# EAGLE design ST link V2_my-2 (EAGLE 8.0.0)
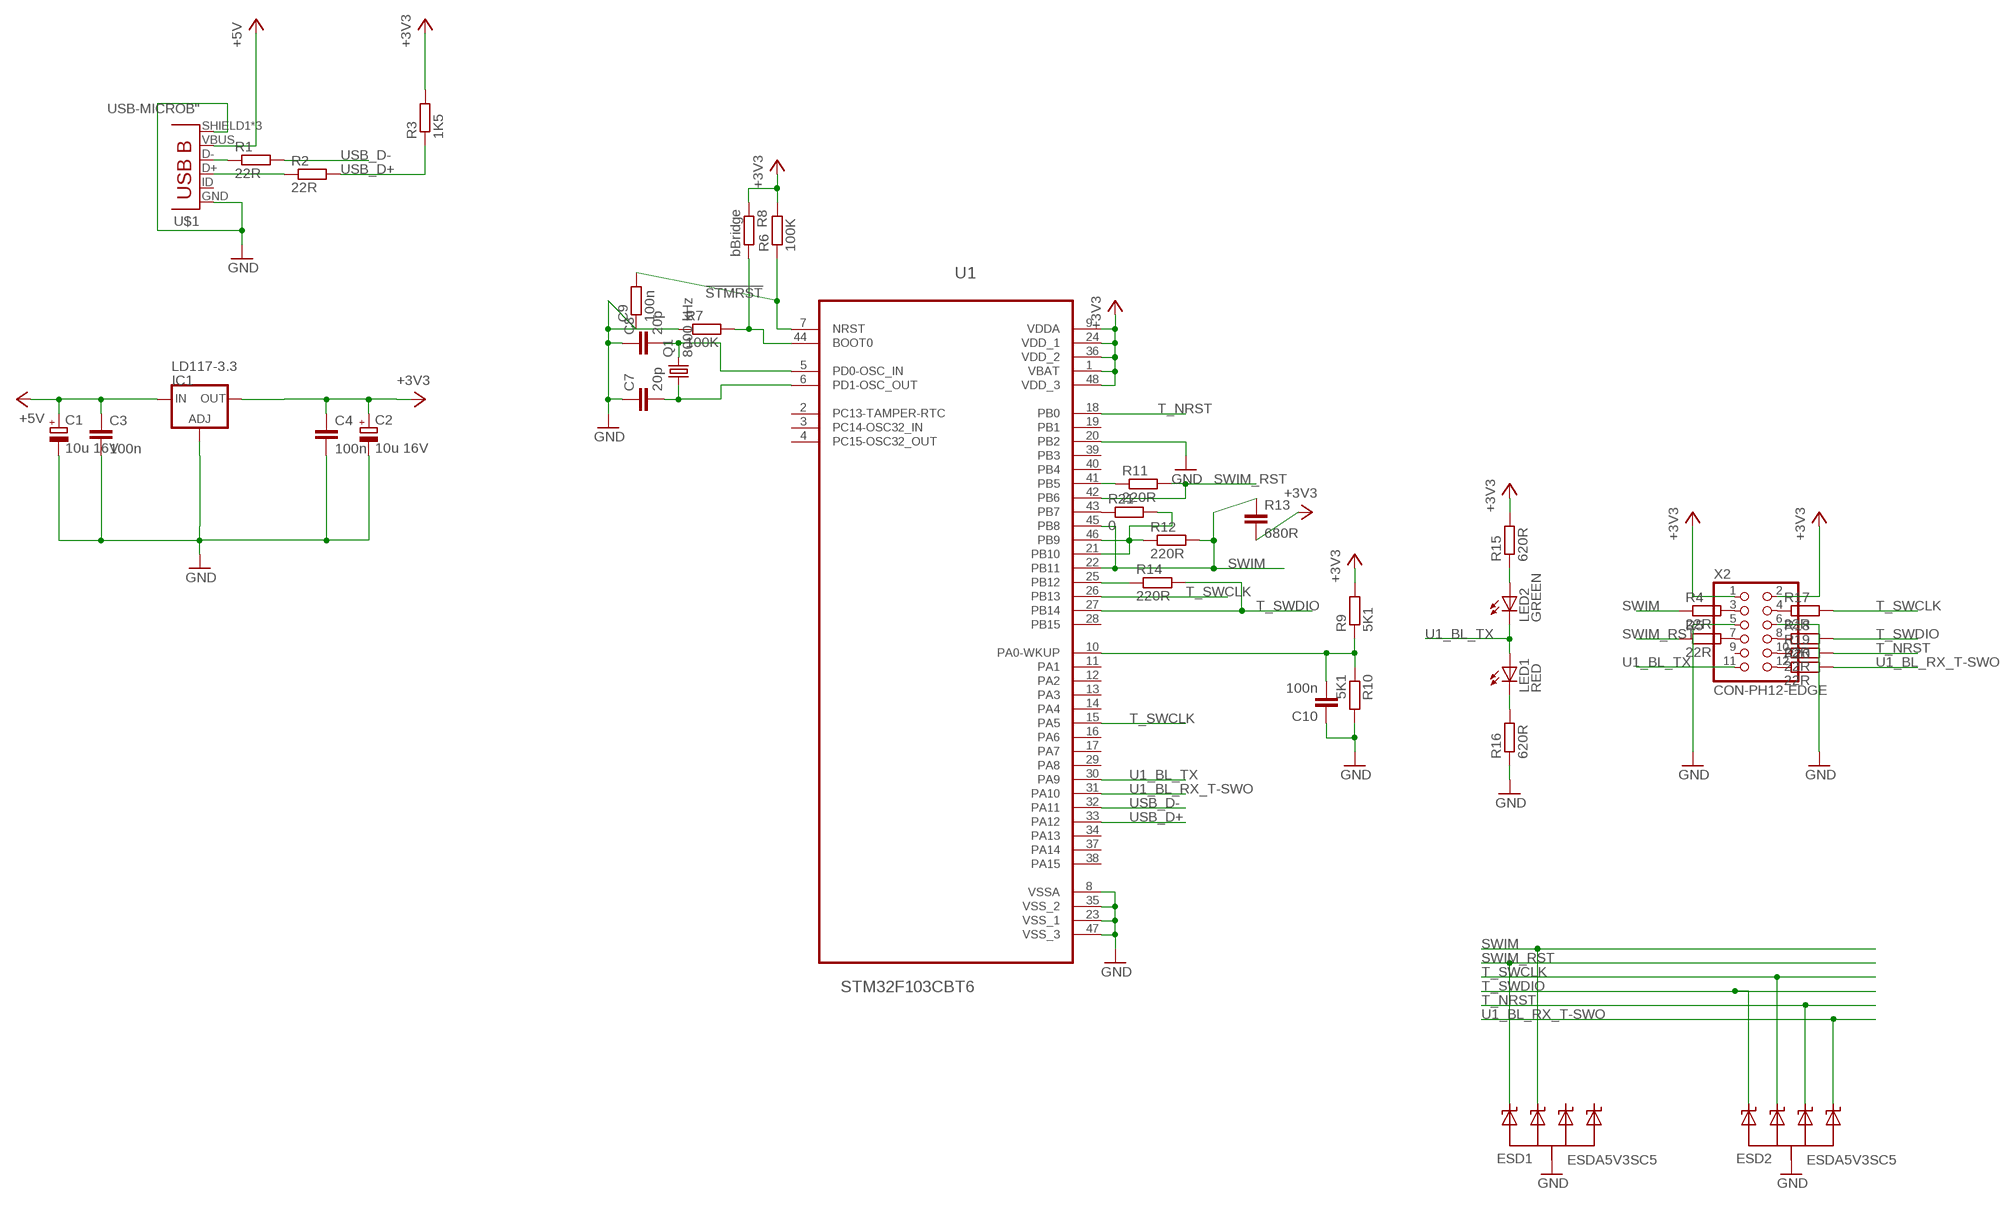
[diagram p0: schematic, sheet 1]

## Parts
C1  10u 16V  CPOL-EUSMCA  [SMC_A]
C2  10u 16V  CPOL-EUSMCA  [SMC_A]
C3  100n  CAP_0805  [C0805]
C4  100n  CAP_0805  [C0805]
C7  20p  CAP_0805  [C0805]
C8  20p  CAP_0805  [C0805]
C9  100n  R_0805  [R0805]
C10  100n  CAP_0805  [C0805]
ESD1  ESDA5V3SC5  ESDAXXSC5  [SOT23-5L]
ESD2  ESDA5V3SC5  ESDAXXSC5  [SOT23-5L]
IC1  LD117-3.3  LD117ASTR  [SOT223]
LED1  RED  LEDCHIPLED_1206  [CHIPLED_1206]
LED2  GREEN  LEDCHIPLED_1206  [CHIPLED_1206]
Q1  8000 kHz  CRYSTALHC49UP  [HC49UP]
R1  22R  R_0805  [R0805]
R2  22R  R_0805  [R0805]
R3  1K5  R_0805  [R0805]
R4  22R  R_0805  [R0805]
R5  22R  R_0805  [R0805]
R6  100K  R_0805  [R0805]
R7  100K  R_0805  [R0805]
R8  bBridge  R_0805  [R0805]
R9  5K1  R_0603  [R0603]
R10  5K1  R_0603  [R0603]
R11  220R  R_0805  [R0805]
R12  220R  R_0805  [R0805]
R13  680R  CAP_0805  [C0805]
R14  220R  R_0805  [R0805]
R15  620R  R_0805  [R0805]
R16  620R  R_0805  [R0805]
R17  22R  R_0805  [R0805]
R18  22R  R_0805  [R0805]
R19  22R  R_0805  [R0805]
R20  22R  R_0805  [R0805]
R21  0  R_0805  [R0805]
U1  STM32F103CBT6  [QFP50P900X900X160-48N]
U$1  USB-MICROB"  [USB-B-MICRO-SMD_V03]
X2  CON-PH12-EDGE  [ML12_EDGE_SMD]

## Nets
!STMRST: C9.2 R6.1 U1.7(NRST)
+3V3: C2.+ C4.1 IC1.4(OUT) R3.2 R6.2 R8.1 R9.2 R13.2 R15.2 U1.1(VBAT) U1.9(VDDA) U1.24(VDD_1) U1.36(VDD_2) U1.48(VDD_3) X2.1 X2.2
+5V: C1.+ C3.1 IC1.3(IN) U$1.VBUS
BOOT0: R7.2 R8.2 U1.44(BOOT0)
GND: C1.- C2.- C3.2 C4.2 C7.1 C8.1 C9.1 C10.1 ESD1.2(A) ESD2.2(A) IC1.1(ADJ) R7.1 R10.2 R16.1 U1.8(VSSA) U1.20(PB2) U1.23(VSS_1) U1.35(VSS_2) U1.47(VSS_3) U$1.GND U$1.SHIELD1(SHIELD) U$1.SHIELD2(SHIELD) U$1.SHIELD3(SHIELD) X2.5 X2.6
N$1: R1.1 U$1.D-
N$2: R2.1 U$1.D+
N$3: R4.2 X2.3
N$4: C10.2 R9.1 R10.1 U1.10(PA0-WKUP)
N$5: R12.1 R21.2 U1.21(PB10) U1.46(PB9)
N$6: C8.2 Q1.2 U1.5(PD0-OSC_IN)
N$7: C7.2 Q1.1 U1.6(PD1-OSC_OUT)
N$8: R11.1 U1.41(PB5)
N$9: R14.1 U1.25(PB12)
N$10: LED2.A R15.1
N$11: R5.2 X2.7
N$12: LED1.C R16.2
N$13: R17.1 X2.4
N$14: R18.1 X2.8
N$15: R19.1 X2.10
N$16: R20.1 X2.12
N$17: R21.1 U1.43(PB7)
SWIM: ESD1.3(C2) R4.1 R12.2 R13.1 U1.22(PB11) U1.45(PB8)
SWIM_RST: ESD1.1(C1) R5.1 R11.2 U1.42(PB6)
T_NRST: ESD2.4(C3) R19.2 U1.18(PB0)
T_SWCLK: ESD2.3(C2) R17.2 U1.15(PA5) U1.26(PB13)
T_SWDIO: ESD2.1(C1) R14.2 R18.2 U1.27(PB14)
U1_BL_RX_T-SWO: ESD2.5(C4) R20.2 U1.31(PA10)
U1_BL_TX: LED1.A LED2.C U1.30(PA9) X2.11
USB_D+: R2.2 R3.1 U1.33(PA12)
USB_D-: R1.2 U1.32(PA11)
Unconnected: ESD1.4(C3) ESD1.5(C4) U1.2(PC13-TAMPER-RTC) U1.3(PC14-OSC32_IN) U1.4(PC15-OSC32_OUT) U1.11(PA1) U1.12(PA2) U1.13(PA3) U1.14(PA4) U1.16(PA6) U1.17(PA7) U1.19(PB1) U1.28(PB15) U1.29(PA8) U1.34(PA13) U1.37(PA14) U1.38(PA15) U1.39(PB3) U1.40(PB4) U$1.ID(USBID) X2.9

## Library data of the parts
C1 C2 = rcl:CPOL-EU: POLARIZED CAPACITOR, European symbol
C3 C4 C7 C8 C10 R13 = Namenlos:CAP_
C9 R1-R12 R14-R21 = Namenlos:R_
ESD1 ESD2 = Namenlos:ESDAXXSC5
IC1 = v-reg:LD117A?*: Low drop fixed and adjustable positive voltage regulators 1 A Source: http://www.st.com/stonline/products/literature/ds/7194/ld1117axx.pdf
LED1 LED2 = led:LED: LED OSRAM: - CHIPLED LG R971, LG N971, LY N971, LG Q971, LY Q971, LO R971, LY R971 LH N974, LH R974 LS Q976, LO Q976, LY Q976 LO Q996 - Hyper CHIPLED LW Q18S LB Q993, LB Q99A, LB R99A - SideLED LS A670, LO A670, LY A670, LG A670, LP A670 LB A673, LV A673, LT A673, LW A673 LH A674 LY A675 LS A676, LA A676, LO A676, LY A676, LW A676 LS A679, LY A679, LG A679 - Hyper Micro SIDELED® LS Y876, LA Y876, LO Y876, LY Y876 LT Y87S - SmartLED LW L88C, LW L88S LB L89C, LB L89S, LG L890 LS L89K, LO L89K, LY L89K LS L896, LA L896, LO L896, LY L896 - TOPLED LS T670, LO T670, LY T670, LG T670, LP T670 LSG T670, LSP T670, LSY T670, LOP T670, LYG T670 LG T671, LOG T671, LSG T671 LB T673, LV T673, LT T673, LW T673 LH T674 LS T676, LA T676, LO T676, LY T676, LB T676, LH T676, LSB T676, LW T676 LB T67C, LV T67C, LT T67C, LS T67K, LO T67K, LY T67K, LW E67C LS E67B, LA E67B, LO E67B, LY E67B, LB E67C, LV E67C, LT E67C LW T67C LS T679, LY T679, LG T679 LS T770, LO T770, LY T770, LG T770, LP T770 LB T773, LV T773, LT T773, LW T773 LH T774 LS E675, LA E675, LY E675, LS T675 LS T776, LA T776, LO T776, LY T776, LB T776 LHGB T686 LT T68C, LB T68C - Hyper Mini TOPLED® LB M676 - Mini TOPLED Santana® LG M470 LS M47K, LO M47K, LY M47K Source: http://www.osram.convergy.de LUXEON: - LUMILED® LXK2-PW12-R00, LXK2-PW12-S00, LXK2-PW14-U00, LXK2-PW14-V00 LXK2-PM12-R00, LXK2-PM12-S00, LXK2-PM14-U00 LXK2-PE12-Q00, LXK2-PE12-R00, LXK2-PE12-S00, LXK2-PE14-T00, LXK2-PE14-U00 LXK2-PB12-K00, LXK2-PB12-L00, LXK2-PB12-M00, LXK2-PB14-N00, LXK2-PB14-P00, LXK2-PB14-Q00 LXK2-PR12-L00, LXK2-PR12-M00, LXK2-PR14-Q00, LXK2-PR14-R00 LXK2-PD12-Q00, LXK2-PD12-R00, LXK2-PD12-S00 LXK2-PH12-R00, LXK2-PH12-S00 LXK2-PL12-P00, LXK2-PL12-Q00, LXK2-PL12-R00 Source: www.luxeon.com KINGBRIGHT: KA-3528ASYC Source: www.kingbright.com
Q1 = crystal:CRYSTAL: CRYSTAL; OC_FARNELL: unknown; OC_NEWARK: unknown
U1 = ST Microelctronics_By_element14_Batch_1:STM32F103CBT6: Medium-density performance line ARM-based 32-bit MCU; MPN: STM32F103CBT6; OC_FARNELL: 1606327; OC_NEWARK: 11N8296; PACKAGE: QFP-48; SUPPLIER: STMICROELECTRONICS
U$1 = SparkFun-Connectors:USB-MICROB; PROD_ID: CONN-11752
X2 = Namenlos:CON-PH12-EDGE

## Board
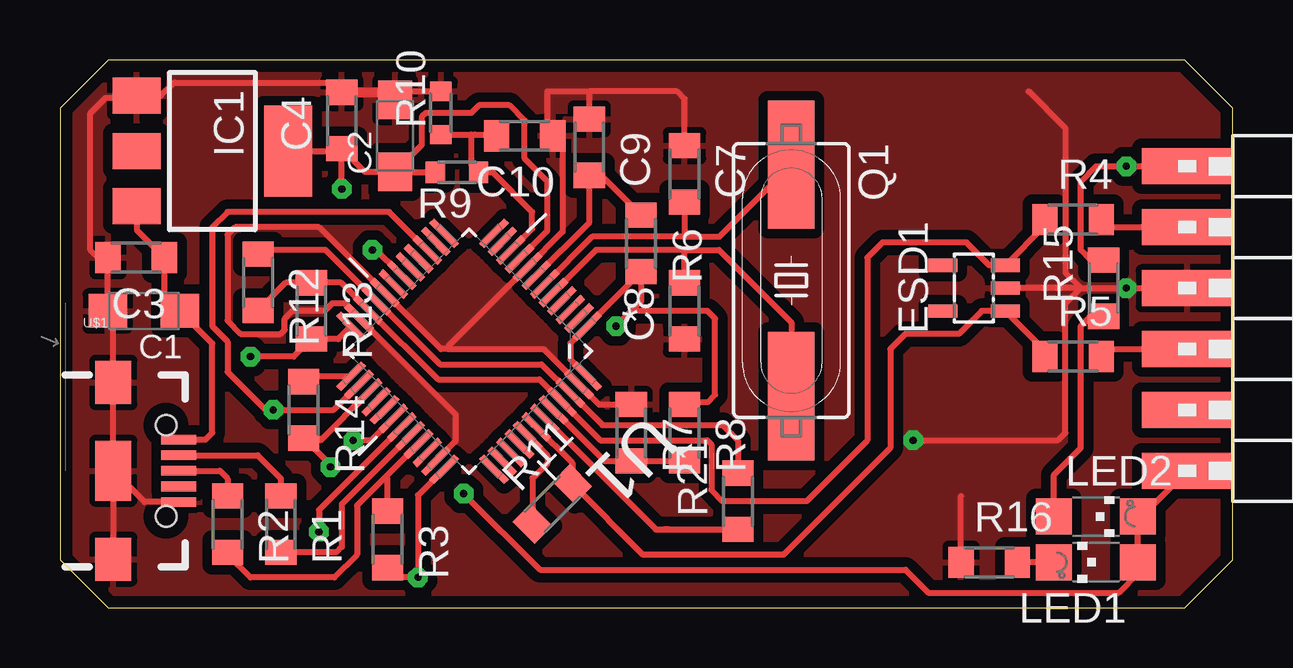
[diagram p1: board, top side]
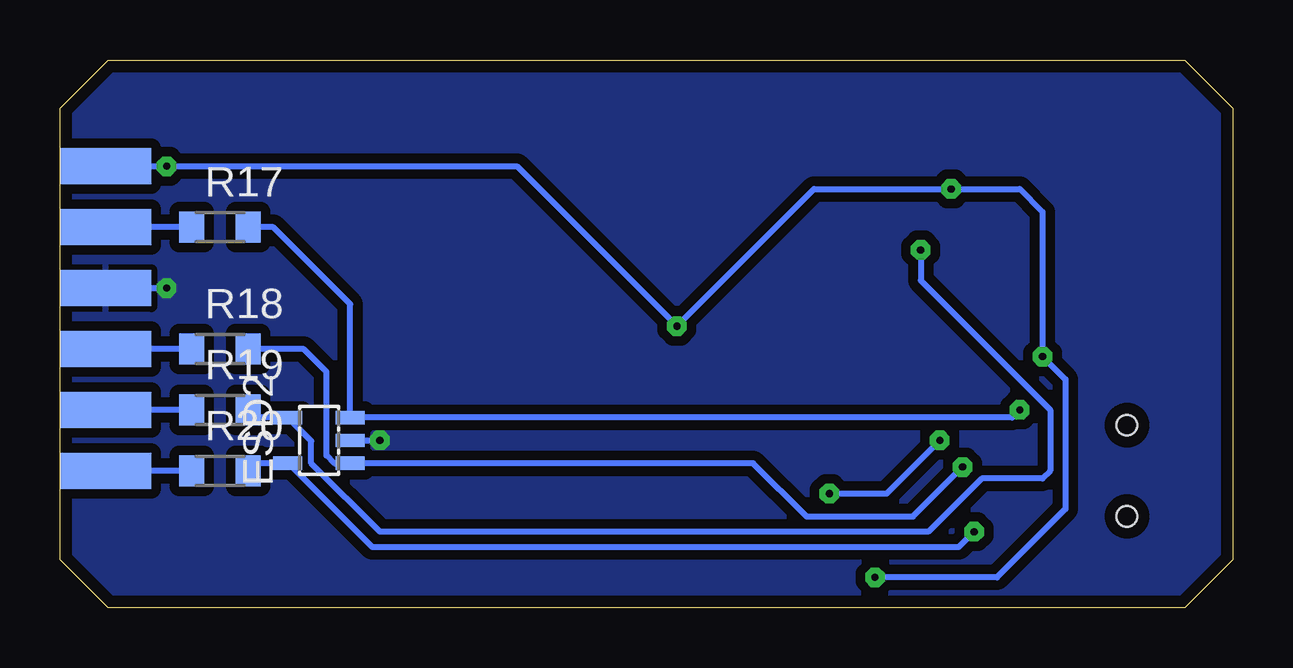
[diagram p2: board, bottom side, seen from below]

Size 48.88 x 22.85 mm. Coordinates in mm from the lower left corner, seen from the top.
Outline: 46.87,22.85 2,22.85 0,20.85 0,2 2,0 46.87,0 48.87,2 48.87,20.85 46.87,22.85
Copper layers (1*16): Top 0.035mm / dielectric 1.5mm / Bottom 0.035mm
Design rules "EagleDesignRules *": minimum track width 0.2mm, minimum drill 0.3mm, track to track 0.2mm, track to pad 0.2mm, pad to pad 0.2mm, via to via 0.2mm, smd to smd 0.2mm, copper to edge 0.5mm, drill to drill 0.2mm, minimum pad ring 10mil, minimum via ring 8mil, stop-mask expansion 4mil, vias tented up to drill 0mil, thermal gap 0.25mm

### Footprints (pad centres in the part's own frame; a part is rotated, then mirrored left to right if it is on the bottom)
SMC_A = smd 1.6 x 1.4: + -1.5,0; - 1.5,0
C0805 = smd 1.05 x 1.3: 1 -1.175,0; 2 1.175,0
R0805 = smd 1.05 x 1.3: 1 -1.175,0; 2 1.175,0
SOT23-5L = smd 0.55 x 1.2: 1 -0.95,-1.3; 2 0,-1.3; 3 0.95,-1.3; 4 0.95,1.3; 5 -0.95,1.3
SOT223 = smd 1.5 x 2: 1 -2.3,-3.15; 2 0,-3.15; 3 2.3,-3.15 | smd 3.8 x 2: 4 0,3.15
CHIPLED_1206 = smd 1.5 x 1.5: A 0,-1.75; C 0,1.75
HC49UP = smd 5.334 x 1.93: 1 -4.826,0; 2 4.826,0
R0603 = smd 0.8 x 0.9: 1 -0.9,0; 2 0.9,0
QFP50P900X900X160-48N = smd 1.473 x 0.279: 1 -4.216,2.743; 2 -4.216,2.261; 3 -4.216,1.753; 4 -4.216,1.245; 5 -4.216,0.762; 6 -4.216,0.254; 7 -4.216,-0.254; 8 -4.216,-0.762; 9 -4.216,-1.245; 10 -4.216,-1.753; 11 -4.216,-2.261; 12 -4.216,-2.743; 25 4.216,-2.743; 26 4.216,-2.261; 27 4.216,-1.753; 28 4.216,-1.245; 29 4.216,-0.762; 30 4.216,-0.254; 31 4.216,0.254; 32 4.216,0.762; 33 4.216,1.245; 34 4.216,1.753; 35 4.216,2.261; 36 4.216,2.743 | smd 0.279 x 1.473: 13 -2.743,-4.216; 14 -2.261,-4.216; 15 -1.753,-4.216; 16 -1.245,-4.216; 17 -0.762,-4.216; 18 -0.254,-4.216; 19 0.254,-4.216; 20 0.762,-4.216; 21 1.245,-4.216; 22 1.753,-4.216; 23 2.261,-4.216; 24 2.743,-4.216; 37 2.743,4.216; 38 2.261,4.216; 39 1.753,4.216; 40 1.245,4.216; 41 0.762,4.216; 42 0.254,4.216; 43 -0.254,4.216; 44 -0.762,4.216; 45 -1.245,4.216; 46 -1.753,4.216; 47 -2.261,4.216; 48 -2.743,4.216
USB-B-MICRO-SMD_V03 = smd 1.45 x 0.4: D+ 2.725,0; D- 2.725,0.65; GND 2.725,-1.3; ID 2.725,-0.65; VBUS 2.725,1.3 | smd 1.5 x 1.8: SHIELD1 0,3.685; SHIELD2 0,-3.685 | smd 1.5 x 2.5: SHIELD3 0,0 | hole 0.85: 2.2,1.9; 2.2,-1.9
ML12_EDGE_SMD = smd 1.5 x 3.81: 1 -6.35,-6.35; 3 -3.81,-6.35; 5 -1.27,-6.35; 7 1.27,-6.35; 9 3.81,-6.35; 11 6.35,-6.35 | smd 1.5 x 3.81 bottom: 2 -6.35,-6.35; 4 -3.81,-6.35; 6 -1.27,-6.35; 8 1.27,-6.35; 10 3.81,-6.35; 12 6.35,-6.35

### Placement (x,y rotation side)
C1  3.49,12.38 180 top
C2  13.97,19.68 90 top
C3  3.17,14.61 180 top
C4  11.75,20.32 90 top
C7  26.04,18.1 270 top
C8  26.04,12.38 90 top
C9  22.07,19.21 270 top
C10  19.37,19.68 180 top
ESD1  38.1,13.34 90 top
ESD2  38.1,6.99 90 bottom
IC1  6.35,19.05 270 top
LED1  43.18,1.9 90 top
LED2  43.18,3.81 270 top
Q1  30.48,13.65 270 top
R1  9.21,3.49 270 top
R2  6.99,3.49 270 top
R3  13.65,2.86 270 top
R4  42.23,16.19 0 top
R5  42.23,10.48 0 top
R6  24.22,15.2 270 top
R7  23.81,7.3 270 top
R8  26.04,7.3 270 top
R9  16.55,18.16 180 top
R10  15.88,20.64 90 top
R11  20.53,4.33 45 top
R12  8.26,13.57 270 top
R13  10.48,12.38 270 top
R14  10.16,8.26 270 top
R15  43.5,13.34 90 top
R16  38.73,1.9 0 top
R17  42.23,15.88 0 bottom
R18  42.23,10.79 0 bottom
R19  42.23,8.26 0 bottom
R20  42.23,5.71 0 bottom
R21  28.26,4.45 90 top
U1  17.05,10.7 225 top
U$1  2.22,5.71 0 top
X2  53.34,12.07 270 top

### Tracks (layer width: path | path; a pad name or v marks a point on that pad's centre or on a via)
!STMRST
  Top 0.254: C9.2 22.38,18.03 | C9.2 22.07,16.08 U1.7 | R6.1 22.57,18.03 C9.2
+3V3  (via drill 0.3 pad 0.81)
  Top 0.254: IC1.4 11.65,19.05 C4.1 | v7.94,10.48 9.75,10.48 R13.2 11.59,11.21 U1.24 | U1.36 14.92,4.69 v14.92,1.27 14.07,1.27 R3.2 | U1.48 21.27,10.36 21.27,11.04 U1.1 24.22,13.99 R6.2 24.22,12.79 v23.18,11.75 | 14.31,18.16 R9.2 | v23.18,11.75 v23.17,11.74 | X2.2 v44.45,18.42 43.18,18.42 42.54,17.78 42.54,14.92 42.96,14.51 R15.2 | v11.75,17.46 C4.1 | C2.+ 12.71,18.18 C4.1 | R8.1 26.13,8.57 26.99,8.57 27.31,8.89 27.31,12.07 26.99,12.38 23.81,12.38 v23.18,11.75 | U1.9 20.32,15.73 20.32,17.78 19.37,18.73 19.37,20.32 18.73,20.95 17.46,20.95 17.15,20.64 15.24,20.64 15.08,20.48 15.08,19.3 C2.+ | C2.+ 14.29,18.18 | 14.29,18.18 14.31,18.16 | C2.+ 14.29,18.18 | 14.29,18.18 14.31,18.16
  Bottom 0.254: v14.92,1.27 9.84,1.27 6.99,4.13 6.99,9.52 v7.94,10.48 7.94,16.51 8.89,17.46 v11.75,17.46 17.46,17.46 v23.18,11.75 29.84,18.42 v44.45,18.42 X2.2
+5V
  Top 0.254: U$1.VBUS 6.06,7.01 6.35,7.3 6.35,11.02 C1.+ 4.35,13.02 C3.1 3.2,15.76 IC1.3
BOOT0
  Top 0.254: U1.44 22.7,6.13 R7.2 R8.2
GND  (via drill 0.3 pad 0.81)
  Top 0.254: 42.54,13.34 ESD1.2 | 42.54,13.34 v44.45,13.34 X2.6 | U$1.SHIELD3 U$1.SHIELD2 | U$1.SHIELD3 U$1.SHIELD1 2.22,12.15 C1.- C3.2 1.59,14.6 1.27,14.92 1.27,20.64 1.9,21.27 3.12,21.27 IC1.1 4.21,21.35 4.76,21.91 11.34,21.91 C4.2 | U$1.GND 3.52,4.42 U$1.SHIELD3 | U1.35 15.67,6.14 16.51,6.99 16.51,8.05 U1.23 11.86,12.7 11.35,12.7 11.03,12.38 9.68,12.38 9.37,12.07 9.37,11.59 9.21,11.43 7.54,11.43 6.99,11.99 6.99,15.56 7.3,15.87 10.8,15.87 U1.20 15.88,10.79 16.19,10.79 | 16.19,10.79 20.16,10.79 U1.47 22.47,8.48 R7.1 | 22.07,21.54 20.32,21.54 20.32,19.91 C10.1 20.95,19.27 20.95,15.68 U1.8 16.19,10.92 16.19,10.79 | R10.2 14.01,21.54 14.01,21.22 C2.- | C9.1 22.07,21.54 | v35.56,6.99 41.59,6.99 41.91,7.3 41.91,12.7 42.54,13.34 | 40.37,21.54 41.91,20 41.91,13.97 42.54,13.34 | 22.07,21.54 25.72,21.54 26.04,21.22 C7.1 | R16.1 37.56,4.67
  Top 0.406: C4.2 13.97,21.5 C2.-
  Bottom 0.254: X2.6 v44.45,13.34 | ESD2.2 v35.56,6.99
  pour Top (isolate 0.406): 46.9,22.54 2.32,22.54 0.32,20.54 0.32,2 2.32,0 46.9,0 48.9,2 48.9,20.54
  pour Bottom (isolate 0.406): 46.9,22.54 2.32,22.54 0.32,20.54 0.32,2 2.32,0 46.9,0 48.9,2 48.9,20.54
N$1
  Top 0.254: U$1.D- 8.24,6.37 9.21,5.4 R1.1
N$2
  Top 0.254: U$1.D+ 6.67,5.71 6.99,5.4 R2.1
N$3
  Top 0.254: R4.2 43.72,15.87 X2.3
N$4
  Top 0.254: U1.10 19.68,15.81 19.68,16.51 18.03,18.16 R9.1 17.15,18.47 17.15,19.74 | R10.1 17.15,19.74 | 17.15,19.74 17.29,19.74 | 17.15,19.74 18.14,19.74 C10.2
N$5
  Top 0.254: R12.1 8.43,14.92 11.07,14.92 U1.21 15.83,10.16 20.07,10.16 U1.46 22.61,7.62 27.62,7.62 28.26,6.99 R21.2
N$6
  Top 0.254: U1.5 22.35,14.92 26.04,14.92 | 26.04,14.92 27.46,14.92 30.48,11.91 30.48,10.48 | 30.48,10.48 30.59,10.36 30.59,10.16 | Q1.2 30.48,10.48 | C8.2 26.04,14.92
N$7
  Top 0.254: 26.04,15.48 22.19,15.48 U1.6 | 26.04,15.48 27.48,15.48 Q1.1 | C7.2 26.04,15.48
N$8
  Top 0.254: U1.41 20.32,6.36 20.32,6.03 19.69,5.41 R11.1
N$9
  Top 0.254: U1.25 10.55,9.66 10.32,9.43 R14.1
N$10
  Top 0.254: R15.1 42.96,12.16 42.54,11.75 42.54,6.67 41.43,5.55 LED2.A
N$11
  Top 0.254: R5.2 43.72,10.79 X2.7
N$12
  Top 0.254: LED1.C R16.2
N$13
  Bottom 0.254: R17.1 X2.4
N$14
  Bottom 0.254: R18.1 X2.8
N$15
  Bottom 0.254: R19.1 X2.10
N$16
  Bottom 0.254: R20.1 X2.12
N$17
  Top 0.254: 25.4,3.27 25.16,3.27 | 25.4,3.27 R21.1 | U1.43 24.84,3.27 25.4,3.27
SWIM
  Top 0.254: R12.2 9.41,13.56 R13.1 11.72,13.56 U1.22 15.75,9.52 19.99,9.52 U1.45 22.53,6.99 26.99,6.99 27.15,6.83 27.15,4.92 27.62,4.45 31.11,4.45 33.65,6.99 33.65,14.6 34.29,15.24 37.78,15.24 38.74,14.28 ESD1.3 | ESD1.3 39.46,14.28 | R4.1 41.05,15.94 ESD1.3
SWIM_RST
  Top 0.254: ESD1.1 39.46,12.39 | U1.42 21.36,6.04 R11.2 24.3,2.22 30.16,2.22 34.61,6.67 34.61,10.79 35.24,11.43 37.47,11.43 38.42,12.39 ESD1.1 | R5.1 41.05,10.73 ESD1.1
T_NRST  (via drill 0.3 pad 0.81)
  Top 0.254: U1.18 13.02,15.1 v13.02,14.92
  Bottom 0.254: R19.2 40.73,7.93 ESD2.4 38.42,6.95 38.42,6.03 35.56,3.17 12.7,3.17 10.48,5.4 7.94,5.4 7.62,5.71 7.62,8.26 13.02,13.65 v13.02,14.92
T_SWCLK  (via drill 0.3 pad 0.81)
  Top 0.254: U1.15 13.72,16.51 6.99,16.51 6.35,15.87 6.35,11.75 6.99,11.11 6.99,9.84 8.57,8.26 v8.89,8.26 11.41,8.26 U1.26
  Bottom 0.254: v8.89,8.26 9.21,7.94 ESD2.3 36.8,12.67 40.01,15.87 R17.2
T_SWDIO  (via drill 0.3 pad 0.81)
  Top 0.254: U1.27 10.86,6.99 10.77,7.08 R14.2 11.27,5.97 v11.27,5.87
  Bottom 0.254: v11.27,5.87 13.34,3.81 17.78,3.81 20.01,6.04 ESD2.1 37.47,6.04 37.78,6.35 37.78,9.84 38.73,10.79 R18.2 40.96,10.79
U1_BL_RX_T-SWO  (via drill 0.3 pad 0.81)
  Top 0.254: U1.31 10.79,4.09 v10.79,3.17
  Bottom 0.254: R20.2 40.73,6.04 ESD2.5 39.37,6.04 35.88,2.54 11.43,2.54 v10.79,3.17
U1_BL_TX  (via drill 0.3 pad 0.81)
  Top 0.254: U1.30 12.98,6.99 v12.22,6.99 | X2.11 45.08,3.81 LED2.C LED1.A 44.93,1.43 44.13,0.64 36.19,0.64 35.24,1.59 20,1.59 v16.83,4.76
  Bottom 0.254: v12.22,6.99 14.45,4.76 v16.83,4.76
USB_D+
  Top 0.254: R2.2 6.99,2.22 7.94,1.27 11.43,1.27 12.38,2.22 12.38,4.27 13.58,5.47 | 13.58,5.47 U1.33 | R3.1 13.65,5.4 13.58,5.47
USB_D-
  Top 0.254: U1.32 11.75,4.32 11.75,2.54 11.52,2.32 R1.2